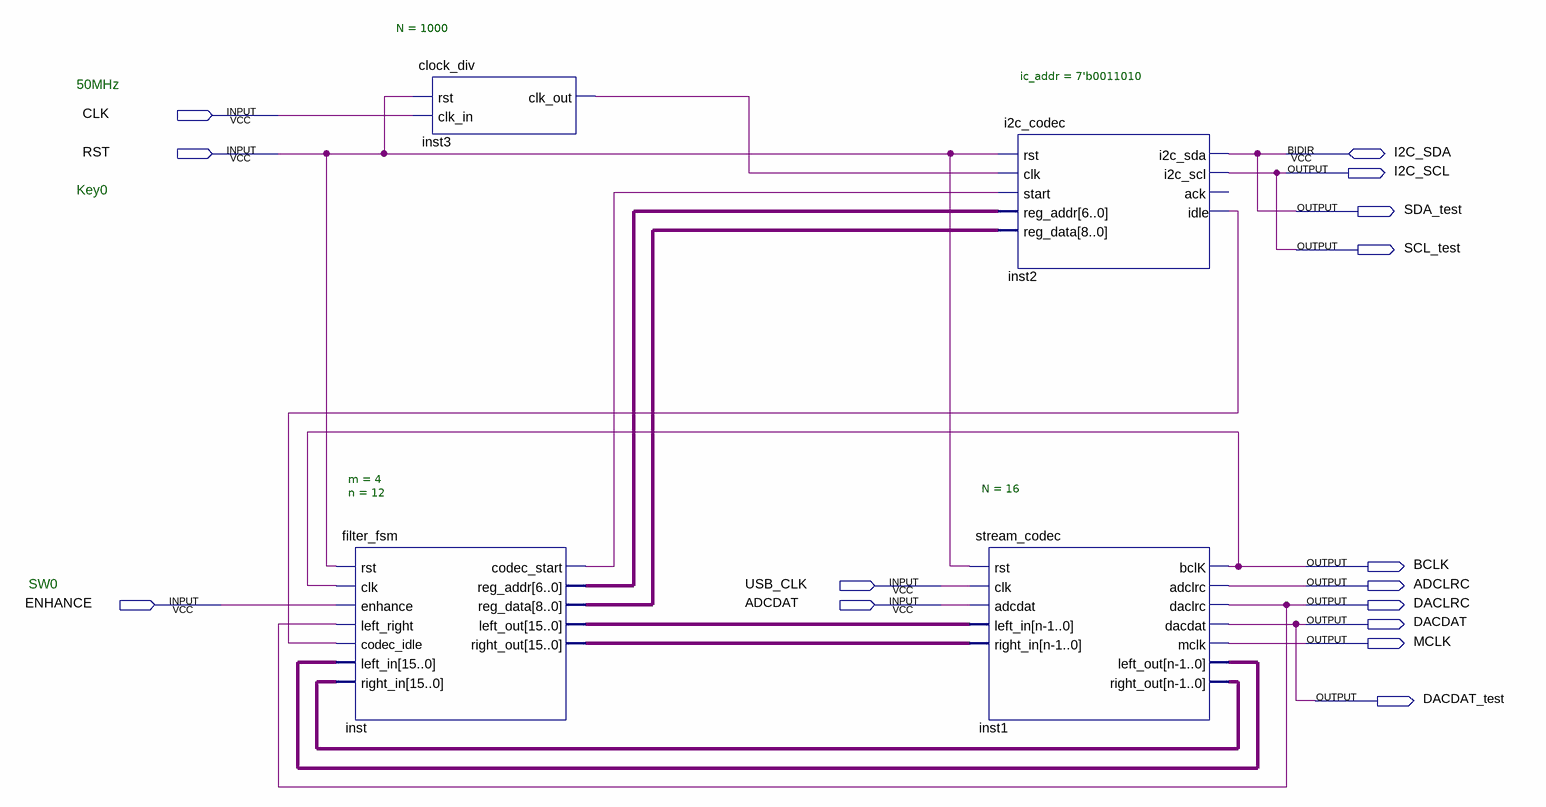
[diagram p0: schematic sheet]
// Quartus schematic top.bdf as structural Verilog: 4 symbols, 15 pins
module top (
  input  CLK,
  input  RST,
  input  USB_CLK,
  input  ENHANCE,
  input  ADCDAT,
  inout  I2C_SDA,
  output I2C_SCL,
  output SDA_test,
  output SCL_test,
  output BCLK,
  output ADCLRC,
  output DACLRC,
  output DACDAT,
  output MCLK,
  output DACDAT_test
);

  wire inst2_idle, inst3_clk_out, inst_codec_start;
  wire [6:0] inst_reg_addr;
  wire [8:0] inst_reg_data;
  wire [15:0] inst1_left_out, inst1_right_out, inst_left_out, inst_right_out;

  filter_fsm #(.m(4), .n(12)) inst (
    .rst(RST), .clk(BCLK), .enhance(ENHANCE), .left_right(DACLRC), .codec_idle(inst2_idle),
    .left_in(inst1_left_out), .right_in(inst1_right_out), .codec_start(inst_codec_start),
    .reg_addr(inst_reg_addr), .reg_data(inst_reg_data), .left_out(inst_left_out), .right_out(inst_right_out));
  clock_div #(.N(1000)) inst3 (.rst(RST), .clk_in(CLK), .clk_out(inst3_clk_out));
  i2c_codec #(.ic_addr(7'b0011010)) inst2 (
    .rst(RST), .clk(inst3_clk_out), .start(inst_codec_start), .reg_addr(inst_reg_addr),
    .reg_data(inst_reg_data), .i2c_scl(I2C_SCL), .idle(inst2_idle), .i2c_sda(I2C_SDA));  // open: ack
  stream_codec #(.N(16)) inst1 (
    .rst(RST), .clk(USB_CLK), .adcdat(ADCDAT), .left_in(inst_left_out), .right_in(inst_right_out),
    .bclK(BCLK), .adclrc(ADCLRC), .daclrc(DACLRC), .dacdat(DACDAT), .mclk(MCLK), .left_out(inst1_left_out),
    .right_out(inst1_right_out));

  assign DACDAT_test = DACDAT;
  assign SCL_test = I2C_SCL;
  assign SDA_test = I2C_SDA;

  // Notes on the sheet:
  //   50MHz
  //   Key0
  //   SW0
endmodule
